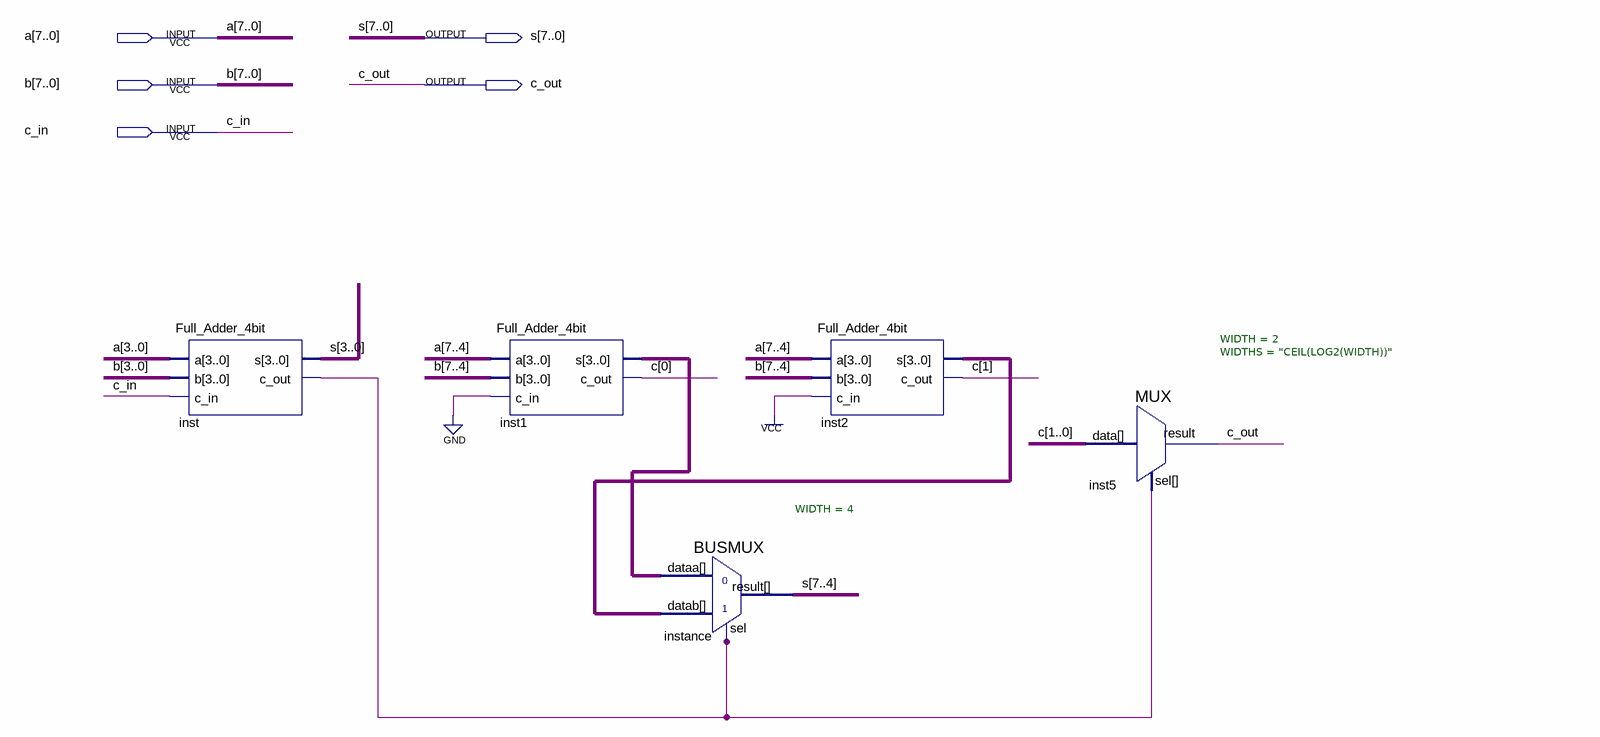
[diagram p0: schematic sheet]
// Quartus schematic CSA_8bit.bdf as structural Verilog: 5 symbols, 5 pins
module CSA_8bit (
  input  [7:0] a,
  input  [7:0] b,
  input  c_in,
  output [7:0] s,
  output c_out
);

  wire inst_c_out;
  wire [1:0] c;
  wire [3:0] inst1_s, inst2_s;

  Full_Adder_4bit inst (.a(a[3:0]), .b(b[3:0]), .c_in(c_in), .s(s[3:0]), .c_out(inst_c_out));
  Full_Adder_4bit inst1 (.a(a[7:4]), .b(b[7:4]), .c_in(1'b0), .s(inst1_s), .c_out(c[0]));
  BUSMUX #(.WIDTH(4)) \instance  (.datab(inst2_s), .sel(inst_c_out), .dataa(inst1_s), .result(s[7:4]));
  Full_Adder_4bit inst2 (.a(a[7:4]), .b(b[7:4]), .c_in(1'b1), .s(inst2_s), .c_out(c[1]));
  MUX #(.WIDTH(2), .WIDTHS("CEIL(LOG2(WIDTH))")) inst5 (.data(c), .sel(inst_c_out), .result(c_out));
endmodule
